# EAGLE design switch (EAGLE 6.5.0)
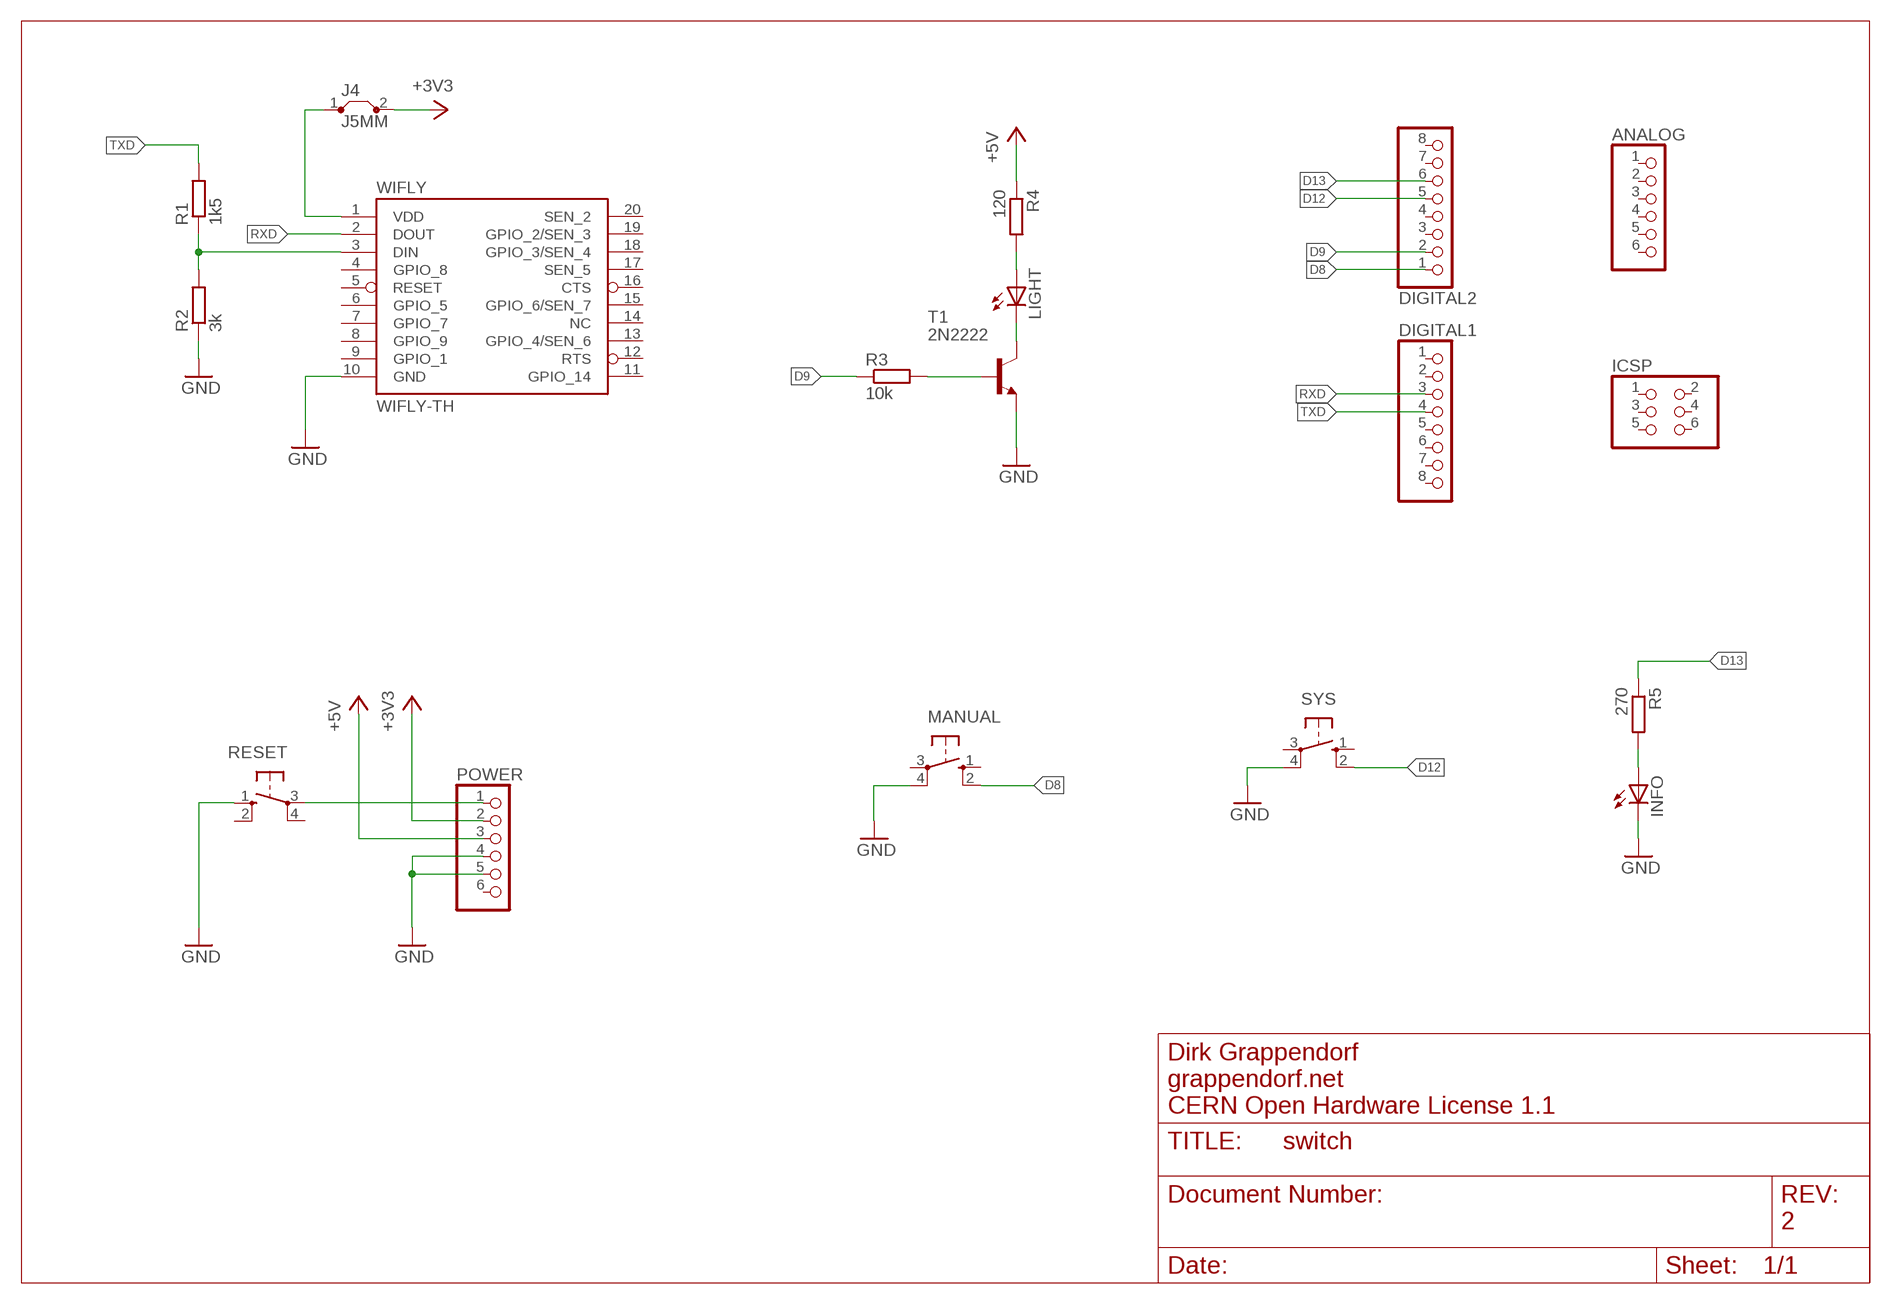
[diagram p0: schematic, sheet 1]

## Parts
ANALOG  PINHD-1X6  [1X06]
DIGITAL1  PINHD-1X8TH  [1X08-TH]
DIGITAL2  PINHD-1X8_2.54  [1X08]
ICSP  PINHD-2X3  [2X03]
INFO  LED3MM  [LED3MM]
J4  J5MM  [05]
LIGHT  LED5MM  [LED5MM]
MANUAL  10-XX  [B3F-10XX]
POWER  PINHD-1X6_2.54  [1X06]
R1  1k5  R-EU_0204/7  [0204/7]
R2  3k  R-EU_0204/7  [0204/7]
R3  10k  R-EU_0204/7  [0204/7]
R4  120  R-EU_0204/7  [0204/7]
R5  270  R-EU_0204/7  [0204/7]
RESET  10-XX  [B3F-10XX]
SYS  10-XX  [B3F-10XX]
T1  2N2222  [TO18]
WIFLY  WIFLY-TH  [WIFLY-TH]

## Nets
+3V3: J4.2 POWER.2
+5V: POWER.3 R4.1
D8: DIGITAL2.1 MANUAL.2(S1)
D9: DIGITAL2.2 R3.1
D12: DIGITAL2.5 SYS.2(S1)
D13: DIGITAL2.6 R5.1
GND: INFO.K(C) MANUAL.4(P1) POWER.4 POWER.5 R2.1 RESET.1(S) SYS.4(P1) T1.1(E) WIFLY.10(GND)
N$1: R1.1 R2.2 WIFLY.3(DIN)
N$2: POWER.1 RESET.3(P)
N$3: R3.2 T1.2(B)
N$4: J4.1 WIFLY.1(VDD)
N$5: LIGHT.K(C) T1.3(C)
N$6: LIGHT.A R4.2
N$7: INFO.A R5.2
RXD: DIGITAL1.3 WIFLY.2(DOUT)
TXD: DIGITAL1.4 R1.2
Unconnected: ANALOG.1 ANALOG.2 ANALOG.3 ANALOG.4 ANALOG.5 ANALOG.6 DIGITAL1.1 DIGITAL1.2 DIGITAL1.5 DIGITAL1.6 DIGITAL1.7 DIGITAL1.8 DIGITAL2.3 DIGITAL2.4 DIGITAL2.7 DIGITAL2.8 ICSP.1 ICSP.2 ICSP.3 ICSP.4 ICSP.5 ICSP.6 MANUAL.1(S) MANUAL.3(P) POWER.6 RESET.2(S1) RESET.4(P1) SYS.1(S) SYS.3(P) WIFLY.4(GPIO_8) WIFLY.5(RESET) WIFLY.6(GPIO_5) WIFLY.7(GPIO_7) WIFLY.8(GPIO_9) WIFLY.9(GPIO_1) WIFLY.11(GPIO_14) WIFLY.12(RTS) WIFLY.13(GPIO_4/SEN_6) WIFLY.14(NC) WIFLY.15(GPIO_6/SEN_7) WIFLY.16(CTS) WIFLY.17(SEN_5) WIFLY.18(GPIO_3/SEN_4) WIFLY.19(GPIO_2/SEN_3) WIFLY.20(SEN_2)

## Notes on the sheet
- Dirk Grappendorf
- grappendorf.net
- CERN Open Hardware License 1.1
- 2

## Library data of the parts
ANALOG = pinhead:PINHD-1X6: PIN HEADER
DIGITAL1 = SmartPrj:PINHD-1X8: PIN HEADER
DIGITAL2 = pinhead-1:PINHD-1X8: PIN HEADER
ICSP = SmartPrj:PINHD-2X3: PIN HEADER
INFO LIGHT = led:LED: LED OSRAM: - CHIPLED LG R971, LG N971, LY N971, LG Q971, LY Q971, LO R971, LY R971 LH N974, LH R974 LS Q976, LO Q976, LY Q976 LO Q996 - Hyper CHIPLED LW Q18S LB Q993, LB Q99A, LB R99A - SideLED LS A670, LO A670, LY A670, LG A670, LP A670 LB A673, LV A673, LT A673, LW A673 LH A674 LY A675 LS A676, LA A676, LO A676, LY A676, LW A676 LS A679, LY A679, LG A679 - Hyper Micro SIDELED® LS Y876, LA Y876, LO Y876, LY Y876 LT Y87S - SmartLED LW L88C, LW L88S LB L89C, LB L89S, LG L890 LS L89K, LO L89K, LY L89K LS L896, LA L896, LO L896, LY L896 - TOPLED LS T670, LO T670, LY T670, LG T670, LP T670 LSG T670, LSP T670, LSY T670, LOP T670, LYG T670 LG T671, LOG T671, LSG T671 LB T673, LV T673, LT T673, LW T673 LH T674 LS T676, LA T676, LO T676, LY T676, LB T676, LH T676, LSB T676, LW T676 LB T67C, LV T67C, LT T67C, LS T67K, LO T67K, LY T67K, LW E67C LS E67B, LA E67B, LO E67B, LY E67B, LB E67C, LV E67C, LT E67C LW T67C LS T679, LY T679, LG T679 LS T770, LO T770, LY T770, LG T770, LP T770 LB T773, LV T773, LT T773, LW T773 LH T774 LS E675, LA E675, LY E675, LS T675 LS T776, LA T776, LO T776, LY T776, LB T776 LHGB T686 LT T68C, LB T68C - Hyper Mini TOPLED® LB M676 - Mini TOPLED Santana® LG M470 LS M47K, LO M47K, LY M47K Source: http://www.osram.convergy.de LUXEON: - LUMILED® LXK2-PW12-R00, LXK2-PW12-S00, LXK2-PW14-U00, LXK2-PW14-V00 LXK2-PM12-R00, LXK2-PM12-S00, LXK2-PM14-U00 LXK2-PE12-Q00, LXK2-PE12-R00, LXK2-PE12-S00, LXK2-PE14-T00, LXK2-PE14-U00 LXK2-PB12-K00, LXK2-PB12-L00, LXK2-PB12-M00, LXK2-PB14-N00, LXK2-PB14-P00, LXK2-PB14-Q00 LXK2-PR12-L00, LXK2-PR12-M00, LXK2-PR14-Q00, LXK2-PR14-R00 LXK2-PD12-Q00, LXK2-PD12-R00, LXK2-PD12-S00 LXK2-PH12-R00, LXK2-PH12-S00 LXK2-PL12-P00, LXK2-PL12-Q00, LXK2-PL12-R00 Source: www.luxeon.com KINGBRIGHT: KA-3528ASYC Source: www.kingbright.com
J4 = jumper:J: Bridge
MANUAL RESET SYS = switch-omron:10-XX: OMRON SWITCH
POWER = pinhead-1:PINHD-1X6: PIN HEADER
R1-R5 = rcl:R-EU_: RESISTOR, European symbol
T1 = transistor:2N2222: NPN TRANSISTOR
WIFLY = grapelabs:WIFLY

## Board
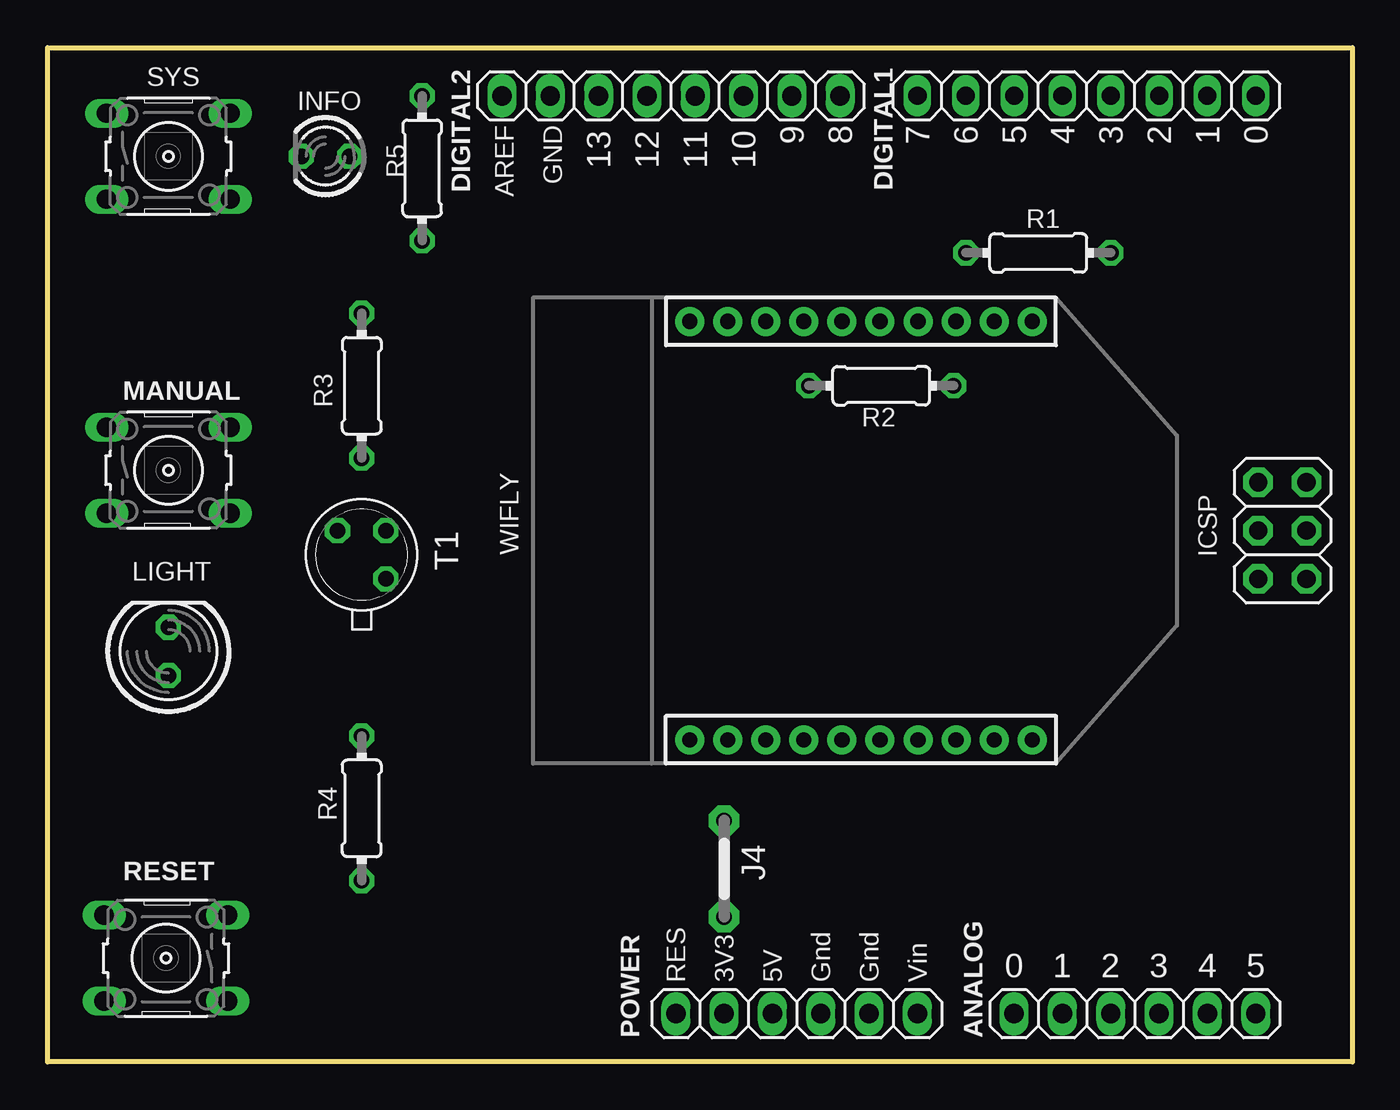
[diagram p1: board, top side]
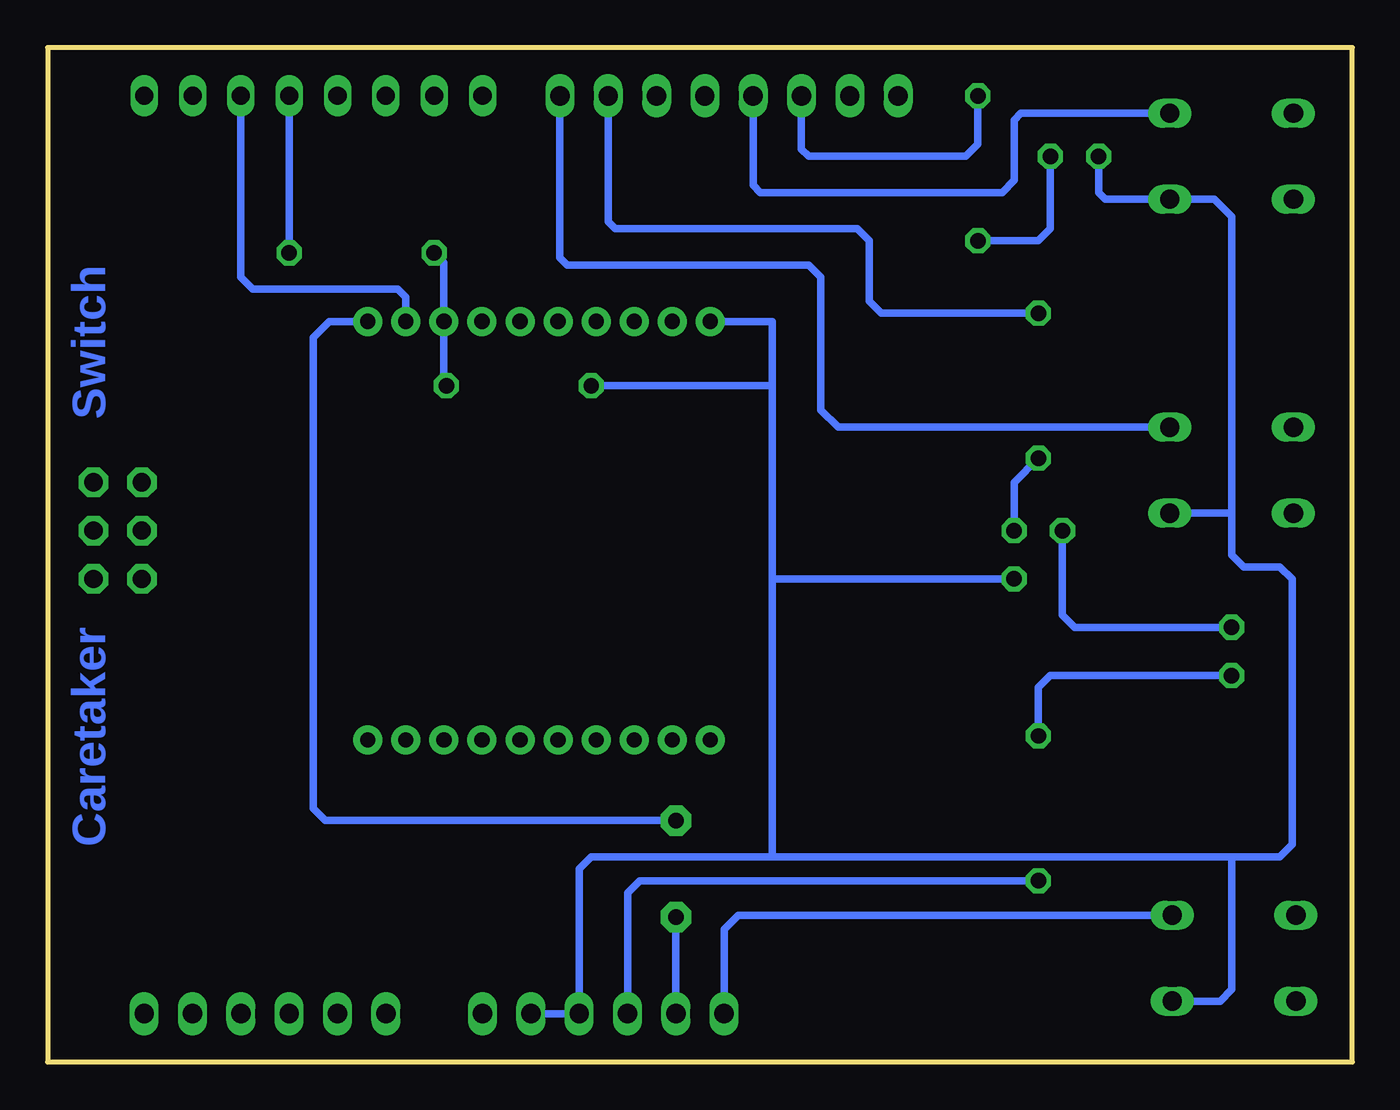
[diagram p2: board, bottom side, seen from below]

Size 68.58 x 53.34 mm. Coordinates in mm from the lower left corner, seen from the top.
Outline: 68.58,53.34 68.58,0 0,0 0,53.34 68.58,53.34
Copper layers (1*16): Top 0.035mm / dielectric 1.5mm / Bottom 0.035mm
Design rules "default": minimum track width 10mil, minimum drill 24mil, track to track 8mil, track to pad 8mil, pad to pad 8mil, via to via 8mil, smd to smd 8mil, copper to edge 40mil, drill to drill 8mil, minimum pad ring 10mil, minimum via ring 8mil, stop-mask expansion 2mil, vias tented up to drill 0mil, thermal gap 10mil

### Footprints (pad centres in the part's own frame; a part is rotated, then mirrored left to right if it is on the bottom)
1X06 = drill 1.016 long: 1 -6.35,0; 2 -3.81,0; 3 -1.27,0; 4 1.27,0; 5 3.81,0; 6 6.35,0
1X08-TH = drill 0.95 pad 1.422 long: 1 -8.89,0; 2 -6.35,0; 3 -3.81,0; 4 -1.27,0; 5 1.27,0; 6 3.81,0; 7 6.35,0; 8 8.89,0
1X08 = drill 1.016 long: 1 -8.89,0; 2 -6.35,0; 3 -3.81,0; 4 -1.27,0; 5 1.27,0; 6 3.81,0; 7 6.35,0; 8 8.89,0
2X03 = drill 0.95 pad 1.55 octagon: 1 -2.54,-1.27; 2 -2.54,1.27; 3 0,-1.27; 4 0,1.27; 5 2.54,-1.27; 6 2.54,1.27
LED3MM = drill 0.813 octagon: A -1.27,0; K 1.27,0
05 = drill 0.813 pad 1.6 octagon: 1 -2.54,0; 2 2.54,0
LED5MM = drill 0.813 octagon: A -1.27,0; K 1.27,0
B3F-10XX = drill 1.016 long: 1 -3.251,2.261; 2 3.251,2.261; 3 -3.251,-2.261; 4 3.251,-2.261
0204/7 = drill 0.813 octagon: 1 -3.81,0; 2 3.81,0
TO18 = drill 0.813 octagon: 1 -1.27,-1.27; 2 1.27,-1.27; 3 1.27,1.27
WIFLY-TH = drill 0.8 pad 1.524: 1 -11,20; 2 -11,18; 3 -11,16; 4 -11,14; 5 -11,12; 6 -11,10; 7 -11,8; 8 -11,6; 9 -11,4; 10 -11,2; 11 11,2; 12 11,4; 13 11,6; 14 11,8; 15 11,10; 16 11,12; 17 11,14; 18 11,16; 19 11,18; 20 11,20

### Placement (x,y rotation side)
ANALOG  57.15,2.54 0 top
DIGITAL1  54.61,50.8 180 top
DIGITAL2  32.77,50.8 180 top
ICSP  64.9,27.94 270 top
INFO  14.61,47.62 180 top
J4  35.56,10.16 270 top
LIGHT  6.35,21.59 90 top
MANUAL  6.35,31.11 0 top
POWER  39.37,2.54 0 top
R1  52.07,42.55 0 top
R2  43.81,35.56 0 top
R3  16.51,35.56 270 top
R4  16.51,13.34 90 top
R5  19.68,46.99 270 top
RESET  6.22,5.46 180 top
SYS  6.35,47.62 0 top
T1  16.51,26.67 90 top
WIFLY  31.75,27.94 270 top

### Tracks (layer width: path | path; a pad name or v marks a point on that pad's centre or on a via)
+3V3
  Bottom 0.406: J4.2 POWER.2
+5V
  Bottom 0.406: R4.1 37.47,9.53 38.1,8.89 POWER.3
D8
  Bottom 0.406: MANUAL.2 27.03,33.38 27.94,34.29 27.94,41.27 28.57,41.91 41.27,41.91 41.66,42.29 DIGITAL2.1
D9
  Bottom 0.406: R3.1 24.77,39.37 25.4,40.01 25.4,43.18 26.04,43.81 38.73,43.81 39.12,44.2 DIGITAL2.2
D12
  Bottom 0.406: SYS.2 17.42,49.89 17.78,49.53 17.78,46.35 18.41,45.72 31.11,45.72 31.5,46.1 DIGITAL2.5
D13
  Bottom 0.406: R5.1 19.68,48.26 20.32,47.62 28.57,47.62 28.96,48.01 DIGITAL2.6
GND
  Bottom 0.406: POWER.5 POWER.4 40.64,10.16 40.01,10.79 30.48,10.79 | 30.48,35.56 30.48,25.4 | R2.1 30.48,35.56 | RESET.1 6.96,3.2 6.35,3.81 6.35,10.79 | WIFLY.10 30.48,38.94 30.48,35.56 | T1.1 30.48,25.4 | 30.48,25.4 30.48,10.79 | INFO.K 13.34,45.72 12.98,45.36 SYS.4 7.26,45.36 6.35,44.45 6.35,28.83 | 6.35,28.83 6.35,26.67 5.71,26.04 3.81,26.04 3.17,25.4 3.17,11.43 3.81,10.79 6.35,10.79 | 6.35,10.79 30.48,10.79 | MANUAL.4 6.38,28.85 6.35,28.83
N$1
  Bottom 0.406: R2.2 47.75,35.69 WIFLY.3 47.75,42.03 R1.1
N$2
  Bottom 0.406: RESET.3 32.28,7.72 33.02,6.99 POWER.1
N$3
  Bottom 0.406: T1.2 17.78,30.48 R3.2
N$4
  Bottom 0.406: WIFLY.1 53.77,38.94 54.61,38.1 54.61,13.34 53.98,12.7 J4.1
N$5
  Bottom 0.406: LIGHT.K 14.61,22.86 15.24,23.5 T1.3
N$6
  Bottom 0.406: LIGHT.A 15.88,20.32 16.51,19.68 R4.2
N$7
  Bottom 0.406: INFO.A 15.88,43.81 16.51,43.18 R5.2
RXD
  Bottom 0.406: WIFLY.2 49.75,40.23 50.16,40.64 57.78,40.64 58.42,41.27 DIGITAL1.3
TXD
  Bottom 0.406: DIGITAL1.4 R1.2

### Text on the board
Bottom: Switch | Caretaker
tPlace: 9 | 8 | 7 | 6 | 5 | 4 | 3 | 2 | 1 | 0 | 13 | 12 | 11 | 10
tNames: AREF | GND | RES | 3V3 | 5V | Gnd | Gnd | Vin | 0 | 1 | 2 | 3 | 4 | 5
bStop: 1 | 2 | 3 | 4 | 5 | 6
Reference: USB | ETH